# Altium project PROC114E3_SCH.PrjPcb (part 14 of 22)

## Sheet 28.SchDoc
size 513 x 386 mm
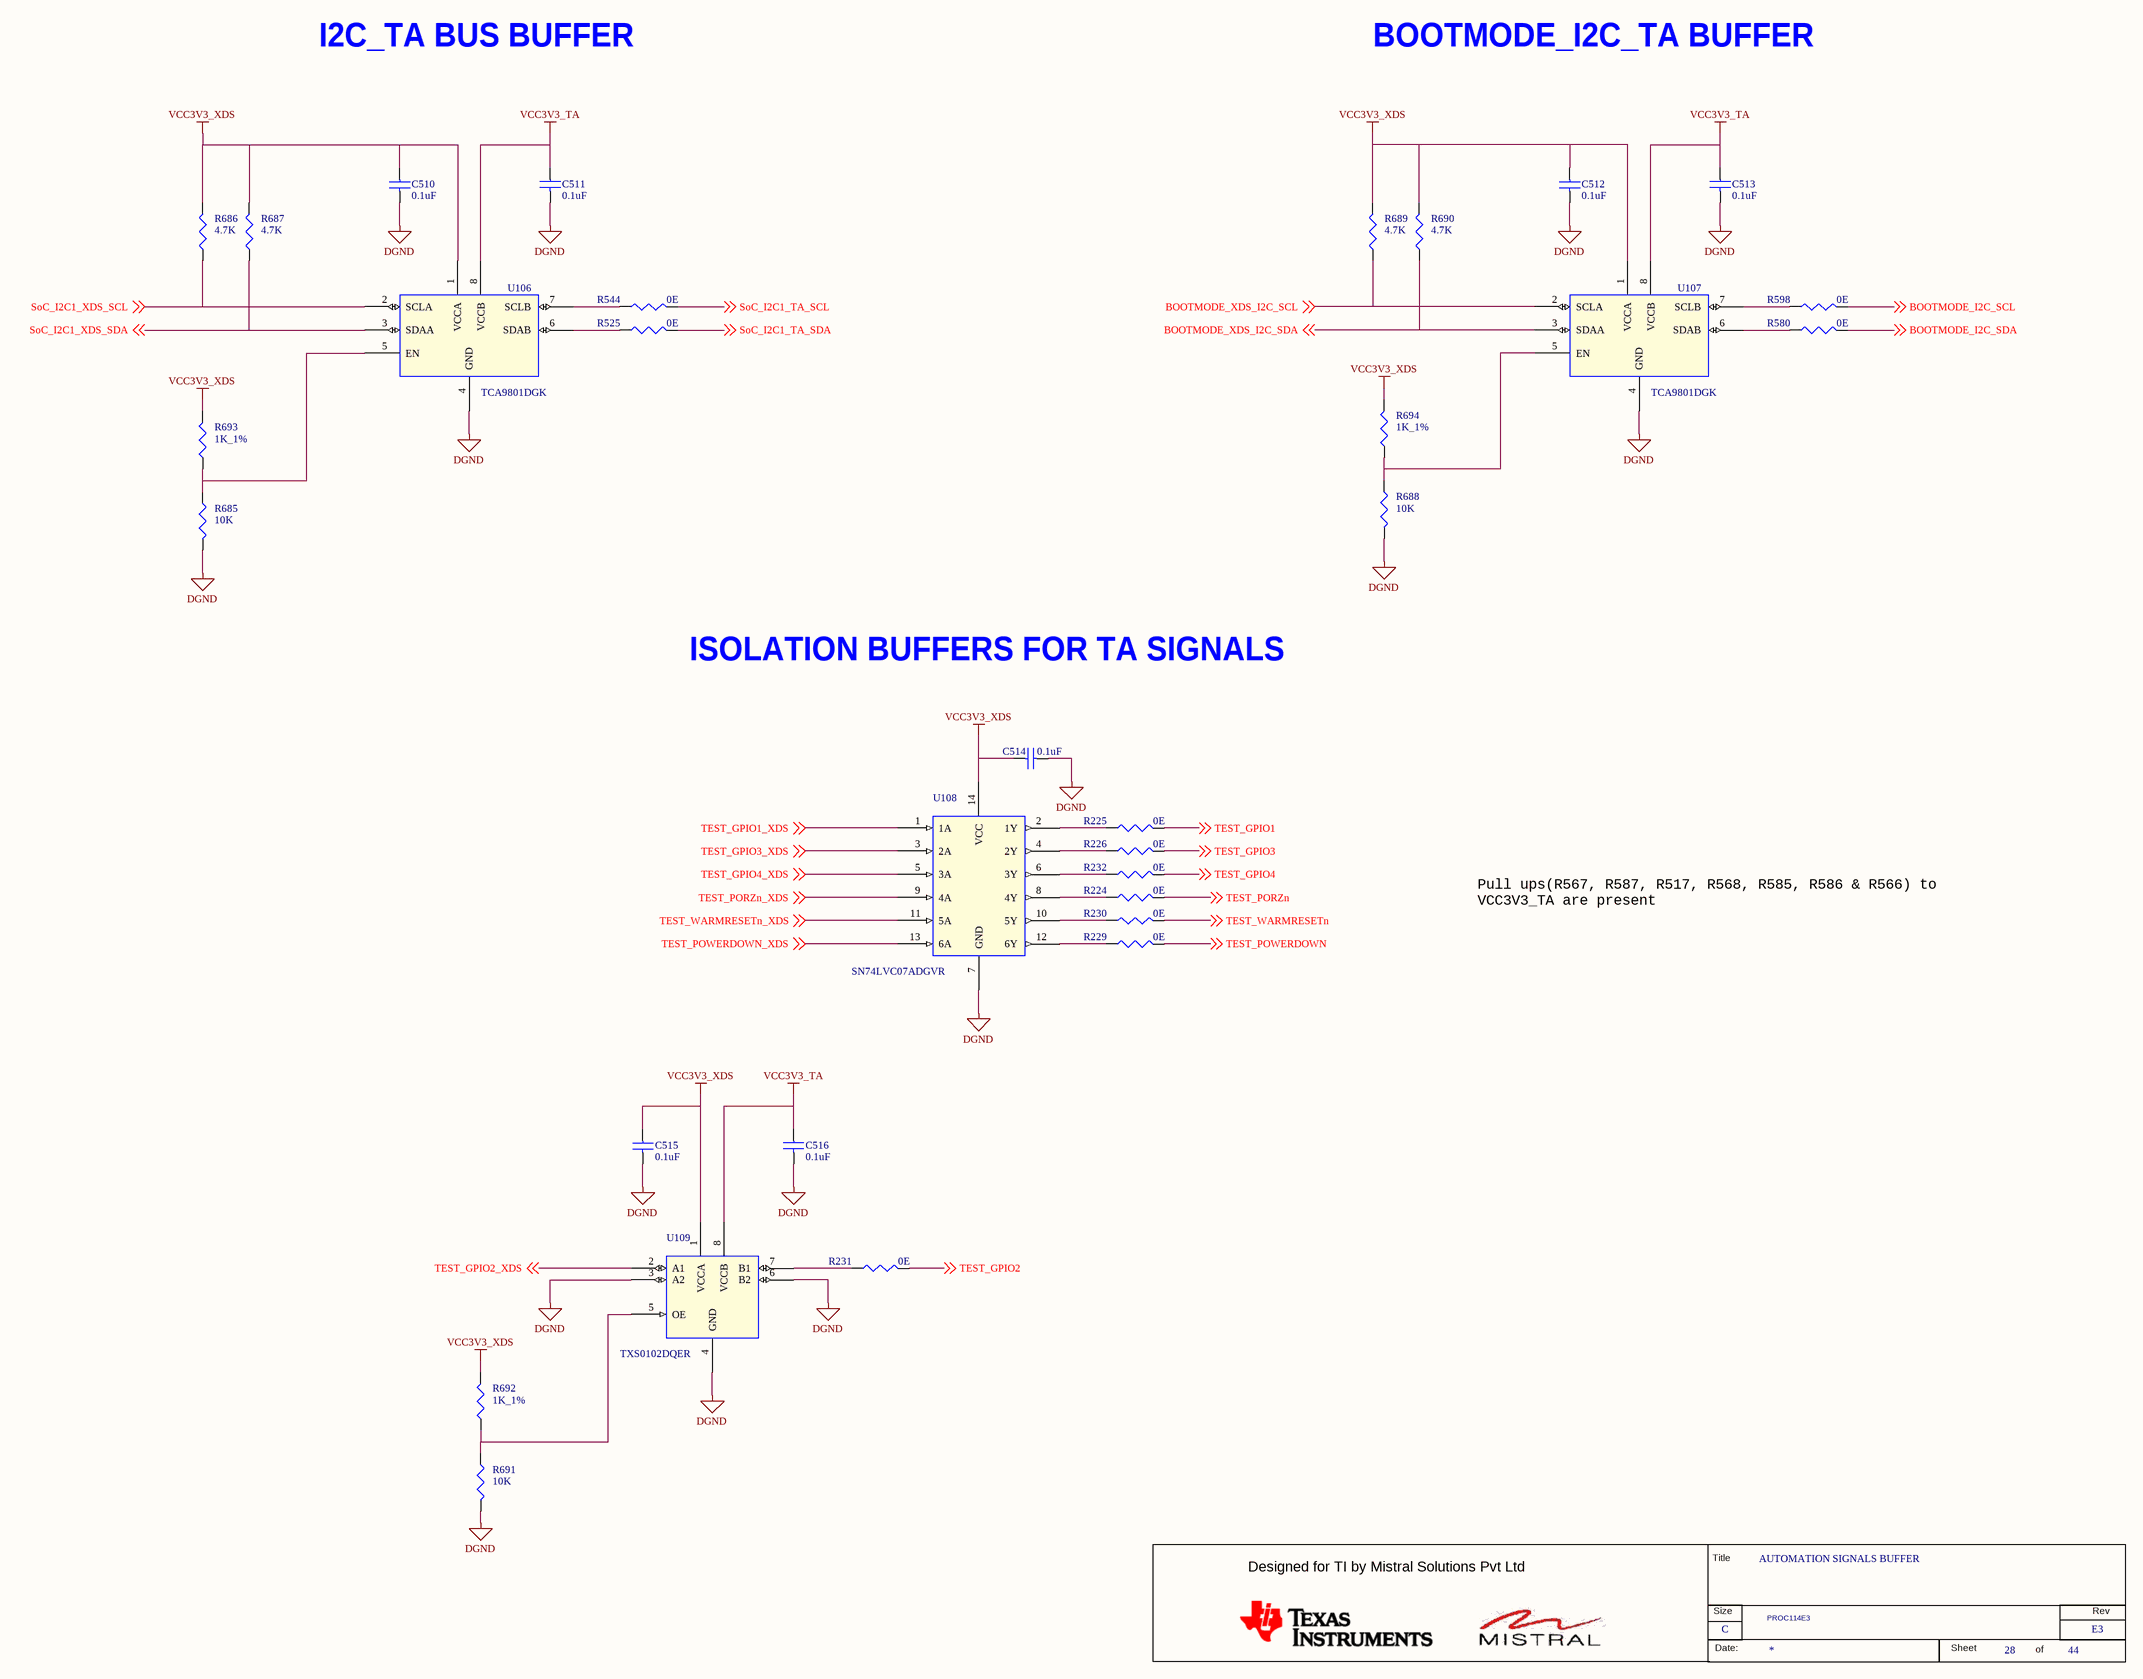
[diagram p45: 28.SchDoc]

### Parts
(Parts that share a designator on the sheet are numbered #1, #2 ... from top to bottom, then left to right.)
*#28  RevCode: E3  Title: AUTOMATION SIGNALS BUFFER  Page Size: C  Page Number: 28  Page Count: 44  Variant Name: PROC114E3  (hidden comment: MISTRAL_TITLEBLK_CSIZE)  (graphical)
C510  0.1uF  [CAP0201_0-5]
C511  0.1uF  [CAP0201_0-5]
C512  0.1uF  [CAP0201_0-5]
C513  0.1uF  [CAP0201_0-5]
C514  0.1uF  [CAP0201_0-5]
C515  0.1uF  [CAP0201_0-5]
C516  0.1uF  [CAP0201_0-5]
R224  0E  [RES0201_0-5]
R225  0E  [RES0201_0-5]
R226  0E  [RES0201_0-5]
R229  0E  [RES0201_0-5]
R230  0E  [RES0201_0-5]
R231  0E  [RES0201_0-5]
R232  0E  [RES0201_0-5]
R525  0E  [RES0201_0-5]
R544  0E  [RES0201_0-5]
R580  0E  [RES0201_0-5]
R598  0E  [RES0201_0-5]
R685  10K  [RES0201_0-5]
R686  4.7K  [RES0201_0-5]
R687  4.7K  [RES0201_0-5]
R688  10K  [RES0201_0-5]
R689  4.7K  [RES0201_0-5]
R690  4.7K  [RES0201_0-5]
R691  10K  [RES0201_0-5]
R692  1K_1%  [RES0402_0-5]
R693  1K_1%  [RES0402_0-5]
R694  1K_1%  [RES0402_0-5]
U106  TCA9801DGK  [VSSOP8_25-59_120X120_1-1]
U107  TCA9801DGK  [VSSOP8_25-59_120X120_1-1]
U108  SN74LVC07ADGVR  [TVSOP14_15-74_180X150_1-2]
U109  TXS0102DQER  [X2SON8_TXS0102_40X60_0-4]

### Nets
DGND: C510.2 C511.2 C512.2 C513.2 C514.2 C515.2 C516.2 R685.1 R688.1 R691.1 U106.4(GND) U107.4(GND) U108.7(GND) U109.3(A2) U109.4(GND) U109.6(B2)
VCC3V3_TA: C511.1 C513.1 C516.1 U106.8(VCCB) U107.8(VCCB) U109.8(VCCB)
VCC3V3_XDS: C510.1 C512.1 C514.1 C515.1 R686.1 R687.1 R689.1 R690.1 R692.2 R693.2 R694.2 U106.1(VCCA) U107.1(VCCA) U108.14(VCC) U109.1(VCCA)
BOOTMODE_I2C_SCL: R598.2 ; off-sheet BOOTMODE_I2C_SCL
BOOTMODE_I2C_SDA: R580.2 ; off-sheet BOOTMODE_I2C_SDA
BOOTMODE_XDS_I2C_SCL: R689.2 U107.2(SCLA) ; off-sheet BOOTMODE_XDS_I2C_SCL
BOOTMODE_XDS_I2C_SDA: R690.2 U107.3(SDAA) ; off-sheet BOOTMODE_XDS_I2C_SDA
SoC_I2C1_TA_SCL: R544.2 ; off-sheet SoC_I2C1_TA_SCL
SoC_I2C1_TA_SDA: R525.2 ; off-sheet SoC_I2C1_TA_SDA
SoC_I2C1_XDS_SCL: R686.2 U106.2(SCLA) ; off-sheet SoC_I2C1_XDS_SCL
SoC_I2C1_XDS_SDA: R687.2 U106.3(SDAA) ; off-sheet SoC_I2C1_XDS_SDA
TEST_GPIO1: R225.2 ; off-sheet TEST_GPIO1
TEST_GPIO1_XDS: U108.1(1A) ; off-sheet TEST_GPIO1_XDS
TEST_GPIO2: R231.2 ; off-sheet TEST_GPIO2
TEST_GPIO2_XDS: U109.2(A1) ; off-sheet TEST_GPIO2_XDS
TEST_GPIO3: R226.2 ; off-sheet TEST_GPIO3
TEST_GPIO3_XDS: U108.3(2A) ; off-sheet TEST_GPIO3_XDS
TEST_GPIO4: R232.2 ; off-sheet TEST_GPIO4
TEST_GPIO4_XDS: U108.5(3A) ; off-sheet TEST_GPIO4_XDS
TEST_PORZn: R224.2 ; off-sheet TEST_PORZn
TEST_PORZn_XDS: U108.9(4A) ; off-sheet TEST_PORZn_XDS
TEST_POWERDOWN: R229.2 ; off-sheet TEST_POWERDOWN
TEST_POWERDOWN_XDS: U108.13(6A) ; off-sheet TEST_POWERDOWN_XDS
TEST_WARMRESETn: R230.2 ; off-sheet TEST_WARMRESETn
TEST_WARMRESETn_XDS: U108.11(5A) ; off-sheet TEST_WARMRESETn_XDS
NetR224_1: R224.1 U108.8(4Y)
NetR225_1: R225.1 U108.2(1Y)
NetR226_1: R226.1 U108.4(2Y)
NetR229_1: R229.1 U108.12(6Y)
NetR230_1: R230.1 U108.10(5Y)
NetR231_1: R231.1 U109.7(B1)
NetR232_1: R232.1 U108.6(3Y)
NetR525_1: R525.1 U106.6(SDAB)
NetR544_1: R544.1 U106.7(SCLB)
NetR580_1: R580.1 U107.6(SDAB)
NetR598_1: R598.1 U107.7(SCLB)
NetR685_2: R685.2 R693.1 U106.5(EN)
NetR688_2: R688.2 R694.1 U107.5(EN)
NetR691_2: R691.2 R692.1 U109.5(OE)

### Notes on the sheet
- I2C_TA BUS BUFFER
- BOOTMODE_I2C_TA BUFFER
- ISOLATION BUFFERS FOR TA SIGNALS
- Pull ups(R567, R587, R517, R568, R585, R586 & R566) to
  VCC3V3_TA are present
- (in symbol MISTRAL_TITLEBLK_CSIZE) Title; Designed for TI by Mistral Solutions Pvt Ltd; Size; Rev; Date:; Sheet; of

### Library data of the parts
*#28 = MISTRAL_TITLEBLK_CSIZE: Issue: 1.0; Page Create Date: March  8, 1995; Page Modify Date: *
C510 C513 C516 = CAP_Dup2: as C325 on sheet 24; Tolerance: 10%; Voltage: 16V; Package: 0201; Distributor_name: DIGIKEY; Distributor_part_number: 490-14305-1-ND; Height: 0.33MM; Weight: 0.33mg; Temperature: -55°C+85°C; Datasheet: Y:\MIS_DATABASE\DATASHEETS\CAPACITORS\GRM033R61C104KE14.PDF; Crtd /date: MANIRAJA/230118; Chkd/date: MANIRAJA/230118; MECHANICAL 3D STEP FILE: CAP0201_0-5; Library Ref: CAP; Footprint Ref: CAP0201_0-5; Library Path: Y:\MIS_DATABASE\Library\ALTIUM_TOOL\SCHEMATICS_PARTS\MS_DISCRETE_Library.schlib; Footprint Path: Y:\MIS_DATABASE\Library\ALTIUM_TOOL\PCB_FOOTPRINTS\Altium_Footprint_Lib.PcbLib; PCB Footprint: CAP0201_0-5
C511 C512 C514 C515 = CAP_Dup2: as C474 on sheet 25; Footprint Path: Y:\MIS_DATABASE\Library\ALTIUM_TOOL\PCB_FOOTPRINTS\Altium_Footprint_Lib.PcbLib; Library Path: Y:\MIS_DATABASE\Library\ALTIUM_TOOL\SCHEMATICS_PARTS\MS_DISCRETE_Library.schlib; Footprint Ref: CAP0201_0-5; Library Ref: CAP; MECHANICAL 3D STEP FILE: CAP0201_0-5; Chkd/date: MANIRAJA/230118; Crtd /date: MANIRAJA/230118; Datasheet: Y:\MIS_DATABASE\DATASHEETS\CAPACITORS\GRM033R61C104KE14.PDF; Temperature: -55°C+85°C; Weight: 0.33mg; Height: 0.33MM; Distributor_part_number: 490-14305-1-ND; Distributor_name: DIGIKEY; Package: 0201; Voltage: 16V; Tolerance: 10%; PCB Footprint: CAP0201_0-5
R224 R226 R229 R231 R232 = RESISTOR_Dup6: RES 0E 1/20W 5% 0201; Part_type: RESISTORS\FIXED; Mfr_part_number: RC0201JR-070RL; Mfr_name: YAGEO AMERICA; Mistral Part No: 110010070067-R; Custom_Duty: 15%; Customs_HS_Code: 85332119; Voltage: NA; Project: PB_BUGBASE; Footprint Path: Y:\MIS_DATABASE\Library\ALTIUM_TOOL\PCB_FOOTPRINTS\Altium_Footprint_Lib.PcbLib; Library Path: Y:\MIS_DATABASE\Library\ALTIUM_TOOL\SCHEMATICS_PARTS\MS_DISCRETE_Library.schlib; MECHANICAL 3D STEP FILE: RES0201_0-5; Chkd/date: NAVEED/301214; Crtd /date: MUDDU/120710; Datasheet: Y:\MIS_DATABASE\DATASHEETS\RESISTORS\RCXXXXL-SER_MAR18.PDF; Temperature: -55°C+125°C; Weight: 0.17mg; Height: 0.26MM; Library Ref: RESISTOR; Distributor_part_number: 311-0.0NCT-ND; Distributor_name: DIGIKEY; Package: 0201; Wattage: 1/20W; Tolerance: 5%; Footprint Ref: RES0201_0-5; PCB Footprint: RES0201_0-5
R225 R230 R525 R544 R580 R598 = RESISTOR_Dup6: RES 0E 1/20W 5% 0201; Mistral Part No: 110010070067-R; Mfr_name: YAGEO AMERICA; Mfr_part_number: RC0201JR-070RL; Part_type: RESISTORS\FIXED; Project: PB_BUGBASE; Voltage: NA; Customs_HS_Code: 85332119; Custom_Duty: 15%; Footprint Ref: RES0201_0-5; Tolerance: 5%; Wattage: 1/20W; Package: 0201; Distributor_name: DIGIKEY; Distributor_part_number: 311-0.0NCT-ND; Library Ref: RESISTOR; Height: 0.26MM; Weight: 0.17mg; Temperature: -55°C+125°C; Datasheet: Y:\MIS_DATABASE\DATASHEETS\RESISTORS\RCXXXXL-SER_MAR18.PDF; Crtd /date: MUDDU/120710; Chkd/date: NAVEED/301214; MECHANICAL 3D STEP FILE: RES0201_0-5; Library Path: Y:\MIS_DATABASE\Library\ALTIUM_TOOL\SCHEMATICS_PARTS\MS_DISCRETE_Library.schlib; Footprint Path: Y:\MIS_DATABASE\Library\ALTIUM_TOOL\PCB_FOOTPRINTS\Altium_Footprint_Lib.PcbLib; PCB Footprint: RES0201_0-5
R685 R688 R691 = RESISTOR_Dup6: as R162 on sheet 24; PCB Footprint: RES0201_0-5; Footprint Path: Y:\MIS_DATABASE\Library\ALTIUM_TOOL\PCB_FOOTPRINTS\Altium_Footprint_Lib.PcbLib; Library Path: Y:\MIS_DATABASE\Library\ALTIUM_TOOL\SCHEMATICS_PARTS\MS_DISCRETE_Library.schlib; Footprint Ref: RES0201_0-5; Library Ref: RESISTOR; Tolerance: 5%; Wattage: 1/20W; Package: 0201; Distributor_name: DIGIKEY; Distributor_part_number: 311-10KNCT-ND; Height: 0.26MM; Weight: 0.17mg; Temperature: -55°C+125°C; Datasheet: Y:\MIS_DATABASE\DATASHEETS\RESISTORS\RCXXXXL-SER_MAR18.PDF; Crtd /date: MANIRAJA/050517; Chkd/date: MANIRAJA/050517; MECHANICAL 3D STEP FILE: RES0201_0-5
R686 R687 = RESISTOR_Dup6: as R498 on sheet 25; Footprint Path: Y:\MIS_DATABASE\Library\ALTIUM_TOOL\PCB_FOOTPRINTS\Altium_Footprint_Lib.PcbLib; Library Path: Y:\MIS_DATABASE\Library\ALTIUM_TOOL\SCHEMATICS_PARTS\MS_DISCRETE_Library.schlib; MECHANICAL 3D STEP FILE: RES0201_0-5; Chkd/date: MANIRAJA/200921; Crtd /date: ALVY/200921; Datasheet: Y:\MIS_DATABASE\DATASHEETS\RESISTORS\RCXXXXL-SER_MAR18.PDF; Temperature: -55°C+125°C; Weight: 0.17mg; Height: 0.26MM; Library Ref: RESISTOR; Distributor_part_number: 311-4.7KNCT-ND; Distributor_name: DIGIKEY; Package: 0201; Wattage: 1/20W; Tolerance: 5%; Footprint Ref: RES0201_0-5; PCB Footprint: RES0201_0-5
R689 R690 = RESISTOR_Dup6: as R600 on sheet 25; Footprint Ref: RES0201_0-5; Tolerance: 5%; Wattage: 1/20W; Package: 0201; Distributor_name: DIGIKEY; Distributor_part_number: 311-4.7KNCT-ND; Library Ref: RESISTOR; Height: 0.26MM; Weight: 0.17mg; Temperature: -55°C+125°C; Datasheet: Y:\MIS_DATABASE\DATASHEETS\RESISTORS\RCXXXXL-SER_MAR18.PDF; Crtd /date: ALVY/200921; Chkd/date: MANIRAJA/200921; MECHANICAL 3D STEP FILE: RES0201_0-5; Library Path: Y:\MIS_DATABASE\Library\ALTIUM_TOOL\SCHEMATICS_PARTS\MS_DISCRETE_Library.schlib; Footprint Path: Y:\MIS_DATABASE\Library\ALTIUM_TOOL\PCB_FOOTPRINTS\Altium_Footprint_Lib.PcbLib; PCB Footprint: RES0201_0-5
R692 R694 = RESISTOR_Dup4: as R527 on sheet 26; PCB Footprint: RES0402_0-5; Chkd/date: VASANTHA/281216; Crtd /date: MAZHAR/150506; Datasheet: Y:\MIS_DATABASE\DATASHEETS\RESISTORS\PAN-ERJSER_NOV17.PDF; Temperature: -55°C+155°C; Weight: 0.8mg; Height: 0.40MM; Distributor_part_number: P1.00KLCT-ND; Distributor_name: DIGIKEY; Package: 0402; Wattage: 1/10W; Tolerance: 1%; Library Ref: RESISTOR; Footprint Ref: RES0402_0-5; MECHANICAL 3D STEP FILE: RES0402_0-5; Library Path: Y:\MIS_DATABASE\Library\ALTIUM_TOOL\SCHEMATICS_PARTS\MS_DISCRETE_Library.schlib; Footprint Path: Y:\MIS_DATABASE\Library\ALTIUM_TOOL\PCB_FOOTPRINTS\Altium_Footprint_Lib.PcbLib
R693 = RESISTOR_Dup4: as R255 on sheet 27; PCB Footprint: RES0402_0-5; Footprint Path: Y:\MIS_DATABASE\Library\ALTIUM_TOOL\PCB_FOOTPRINTS\Altium_Footprint_Lib.PcbLib; Library Path: Y:\MIS_DATABASE\Library\ALTIUM_TOOL\SCHEMATICS_PARTS\MS_DISCRETE_Library.schlib; MECHANICAL 3D STEP FILE: RES0402_0-5; Footprint Ref: RES0402_0-5; Library Ref: RESISTOR; Tolerance: 1%; Wattage: 1/10W; Package: 0402; Distributor_name: DIGIKEY; Distributor_part_number: P1.00KLCT-ND; Height: 0.40MM; Weight: 0.8mg; Temperature: -55°C+155°C; Datasheet: Y:\MIS_DATABASE\DATASHEETS\RESISTORS\PAN-ERJSER_NOV17.PDF; Crtd /date: MAZHAR/150506; Chkd/date: VASANTHA/281216
U106 U107 = TCA9801DGK_VSSOP8: IC LEVEL TRANSLATING I2C BUS BUFFER/REPEATER VSSOP8; Part_type: ICS\INTERFACE\LEVEL TRANSLATOR; Mfr_part_number: TCA9801DGKT; Mfr_name: TEXAS INSTRUMENTS; Mistral Part No: 141018070002-R; Custom_Duty: 15%; Customs_HS_Code: 85423100; Wattage: NA; Project: DARE_RFAM_RF; PCB Footprint: VSSOP8_25-59_120X120_1-1; Footprint Path: Y:\MIS_DATABASE\Library\ALTIUM_TOOL\PCB_FOOTPRINTS\Altium_Footprint_Lib.PcbLib; Library Path: Y:\MIS_DATABASE\Library\ALTIUM_TOOL\SCHEMATICS_PARTS\MS_MISCINTERFACE_Library.schlib; MECHANICAL 3D STEP FILE: VSSOP8_25-59_120X120_1-1; Chkd/date: MANIRAJA/020718; Crtd /date: MANIRAJA/020718; Datasheet: Y:\MIS_DATABASE\DATASHEETS\ICS\INTERFACE\TCA9801DGK.PDF; Temperature: -40°C+85°C; Weight: 20mg; Height: 1.10MM; Library Ref: TCA9801DGK_VSSOP8; Distributor_part_number: 296-46571-1-ND; Distributor_name: DIGIKEY; Package: VSSOP8; Voltage: NA; Tolerance: NA; Footprint Ref: VSSOP8_25-59_120X120_1-1
U108 = 74HC7014X_SOIC14: IC HEX BUFFER AND DRIVER WITH OPEN DRAIN OUTPUT TVSOP14; Part_type: ICS\DIGITAL\COMBINATIONAL; Mfr_name: TEXAS INSTRUMENTS; Mistral Part No: 141022040005-R; Custom_Duty: 15%; Customs_HS_Code: 85423100; Wattage: NA; Project: TI_AM62x_SKEVM_BRD; Footprint Path: Y:\MIS_DATABASE\Library\ALTIUM_TOOL\PCB_FOOTPRINTS\Altium_Footprint_Lib.PcbLib; Library Path: Y:\MIS_DATABASE\Library\ALTIUM_TOOL\SCHEMATICS_PARTS\MS_COMBINATIONAL_Library.schlib; MECHANICAL 3D STEP FILE: TVSOP14_15-74_180X150_1-2; Chkd/date: ALVY/070422; Crtd /date: TAMILARASU/070422; Datasheet: Y:\MIS_DATABASE\DATASHEETS\ICS\DIGITAL\COMBINATIONAL\SN74LVC07A.PDF; Temperature: -40°C+125°C; Weight: 41.8mg; Height: 1.20MM; Library Ref: 74HC7014X_SOIC14; Distributor_part_number: 296-8440-1-ND; Distributor_name: DIGIKEY; Package: TVSOP14; Voltage: NA; Tolerance: NA; Mfr_part_number: SN74LVC07ADGVR; Footprint Ref: TVSOP14_15-74_180X150_1-2; PCB Footprint: TVSOP14_15-74_180X150_1-2
U109 = TXS0102DQX_SON8: IC 2-BIT BI-DIR VOLTAGE-LEVEL TRANSLATOR FOR OPEN-DRAIN AND PUSH-PULL X2SON8; Part_type: ICS\INTERFACE\LEVEL TRANSLATOR; Mfr_name: TEXAS INSTRUMENTS; Mistral Part No: 141012050010-R; Custom_Duty: 15%; Customs_HS_Code: 85423100; Wattage: NA; Project: GEN_3-8_DB; PCB Footprint: X2SON8_TXS0102_40X60_0-4; Footprint Path: Y:\MIS_DATABASE\Library\ALTIUM_TOOL\PCB_FOOTPRINTS\Altium_Footprint_Lib.PcbLib; Library Path: Y:\MIS_DATABASE\Library\ALTIUM_TOOL\SCHEMATICS_PARTS\MS_MISCINTERFACE_Library.schlib; MECHANICAL 3D STEP FILE: X2SON8_TXS0102_40X60_0-4; Chkd/date: MANIRAJA/010719; Crtd /date: CHAITHANYA230512; Datasheet: Y:\MIS_DATABASE\DATASHEETS\ICS\INTERFACE\TXS0102-SER.PDF; Temperature: -40°C+85°C; Weight: 1.2mg; Height: 0.40MM; Library Ref: TXS0102DQX_SON8; Distributor_part_number: 296-28368-1-ND; Distributor_name: DIGIKEY; Package: X2SON8; Voltage: NA; Tolerance: NA; Mfr_part_number: TXS0102DQER; Footprint Ref: X2SON8_TXS0102_40X60_0-4

## Sheet 29.SchDoc
size 513 x 386 mm
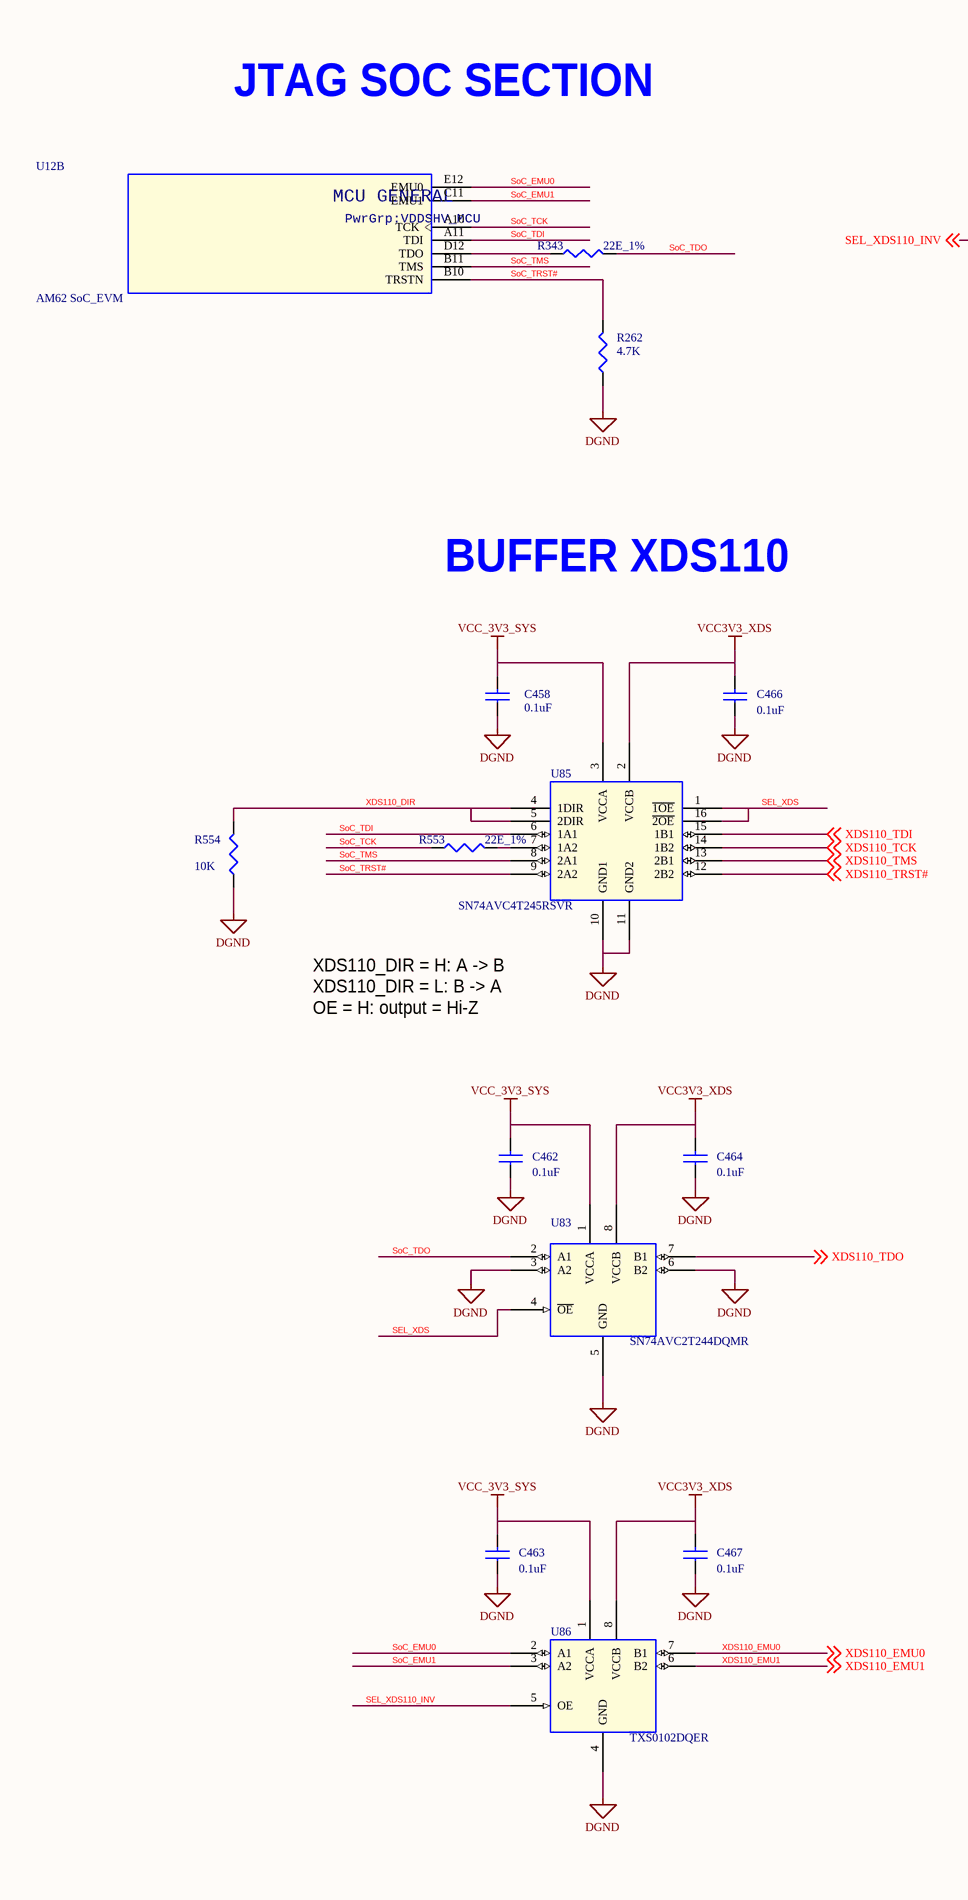
[diagram p46: 29.SchDoc, left]
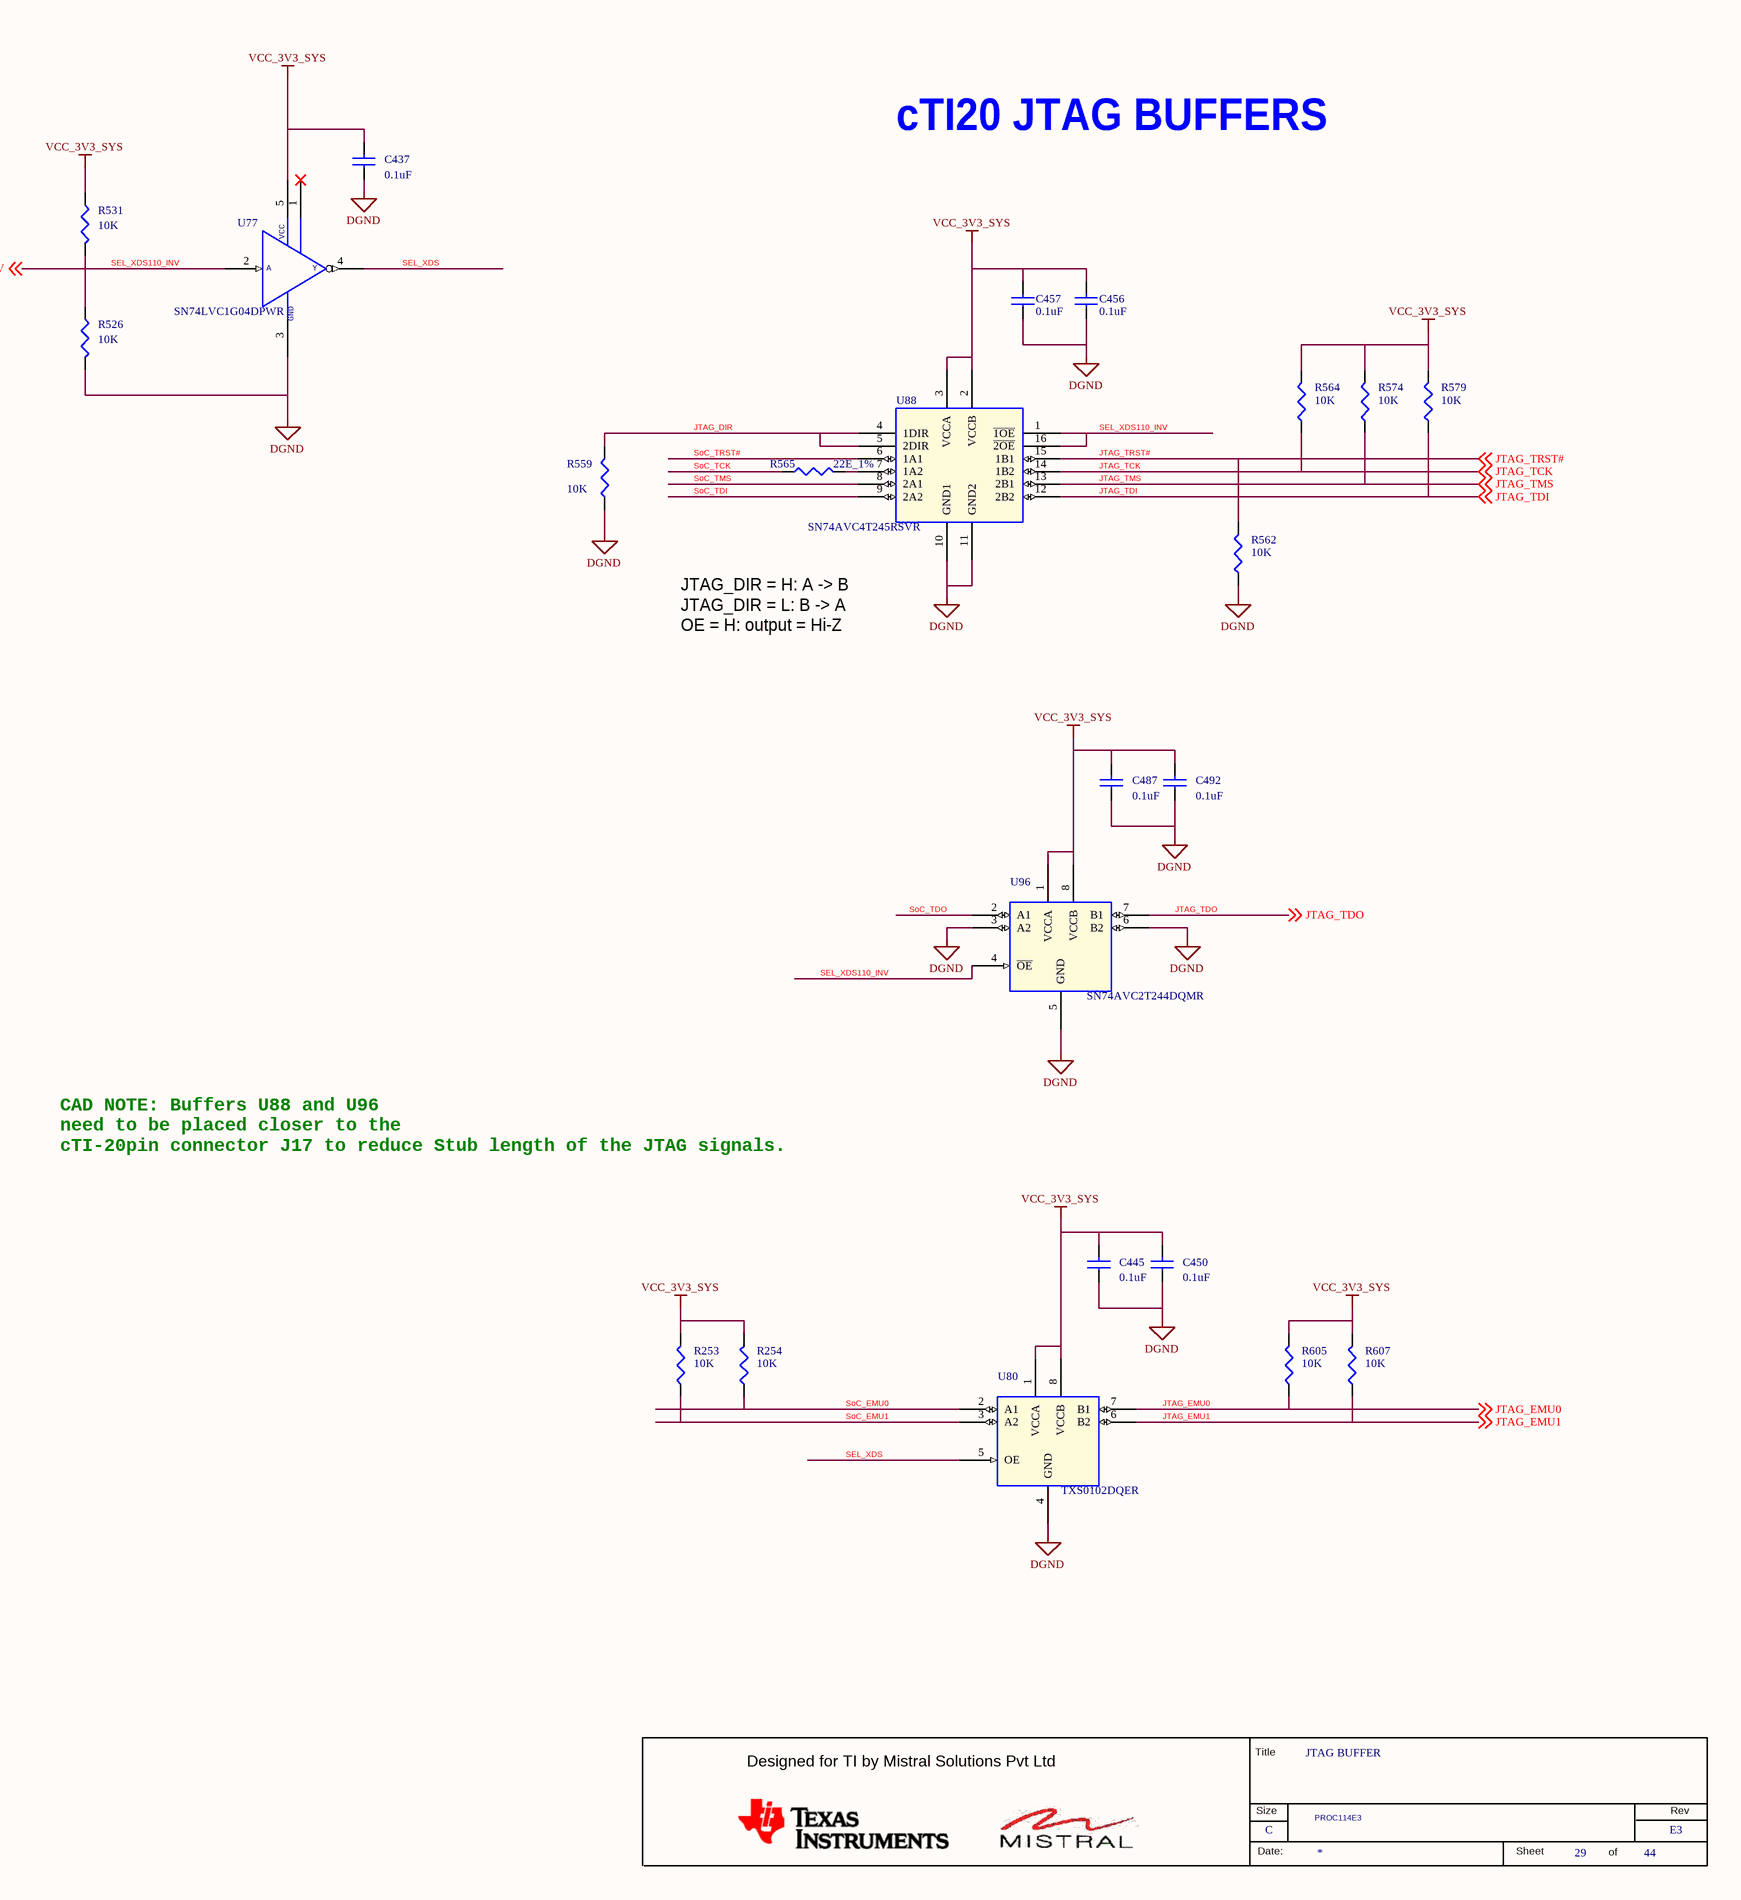
[diagram p47: 29.SchDoc, right]

### Parts
(Parts that share a designator on the sheet are numbered #1, #2 ... from top to bottom, then left to right.)
*#29  RevCode: E3  Title: JTAG BUFFER  Page Size: C  Page Number: 29  Page Count: 44  Variant Name: PROC114E3  (hidden comment: MISTRAL_TITLEBLK_CSIZE)  (graphical)
C437  0.1uF  [CAP0201_0-5]
C445  0.1uF  [CAP0201_0-5]
C450  0.1uF  [CAP0201_0-5]
C456  0.1uF  [CAP0201_0-5]
C457  0.1uF  [CAP0201_0-5]
C458  0.1uF  [CAP0201_0-5]
C462  0.1uF  [CAP0201_0-5]
C463  0.1uF  [CAP0201_0-5]
C464  0.1uF  [CAP0201_0-5]
C466  0.1uF  [CAP0201_0-5]
C467  0.1uF  [CAP0201_0-5]
C487  0.1uF  [CAP0201_0-5]
C492  0.1uF  [CAP0201_0-5]
R253  10K  [RES0201_0-5]
R254  10K  [RES0201_0-5]
R262  4.7K  [RES0201_0-5]
R343  22E_1%  [RES0201_0-5]
R526  10K  [RES0201_0-5]
R531  10K  [RES0201_0-5]
R553  22E_1%  [RES0201_0-5]
R554  10K  [RES0201_0-5]
R559  10K  [RES0201_0-5]
R562  10K  [RES0201_0-5]
R564  10K  [RES0201_0-5]
R565  22E_1%  [RES0201_0-5]
R574  10K  [RES0201_0-5]
R579  10K  [RES0201_0-5]
R605  10K  [RES0201_0-5]
R607  10K  [RES0201_0-5]
U12#2  AM62 SoC_EVM  [BGA425_19-68_510X510_0-7]  (part B of 18)
U77  SN74LVC1G04DPWR  [X2SON5_TLV7021_30X30_0-4]
U80  TXS0102DQER  [X2SON8_TXS0102_40X60_0-4]
U83  SN74AVC2T244DQMR  [X2SON8_15-74_70X50]
U85  SN74AVC4T245RSVR  [UQFN16_TMUX1574_70X100_0-6]
U86  TXS0102DQER  [X2SON8_TXS0102_40X60_0-4]
U88  SN74AVC4T245RSVR  [UQFN16_TMUX1574_70X100_0-6]
U96  SN74AVC2T244DQMR  [X2SON8_15-74_70X50]

### Nets
DGND: C437.1 C445.1 C450.1 C456.1 C457.1 C458.1 C462.1 C463.1 C464.1 C466.1 C467.1 C487.1 C492.1 R262.2 R526.1 R554.1 R559.1 R562.1 U77.3(GND) U80.4(GND) U83.3(A2) U83.5(GND) U83.6(B2) U85.10(GND1) U85.11(GND2) U86.4(GND) U88.10(GND1) U88.11(GND2) U96.3(A2) U96.5(GND) U96.6(B2)
VCC3V3_XDS: C464.2 C466.2 C467.2 U83.8(VCCB) U85.2(VCCB) U86.8(VCCB)
VCC_3V3_SYS: C437.2 C445.2 C450.2 C456.2 C457.2 C458.2 C462.2 C463.2 C487.2 C492.2 R253.1 R254.1 R531.2 R564.2 R574.2 R579.2 R605.1 R607.1 U77.5(VCC) U80.1(VCCA) U80.8(VCCB) U83.1(VCCA) U85.3(VCCA) U86.1(VCCA) U88.2(VCCB) U88.3(VCCA) U96.1(VCCA) U96.8(VCCB)
JTAG_DIR: R559.2 U88.4(1DIR) U88.5(2DIR)
JTAG_EMU0: R605.2 U80.7(B1) ; off-sheet JTAG_EMU0
JTAG_EMU1: R607.2 U80.6(B2) ; off-sheet JTAG_EMU1
JTAG_TCK: R564.1 U88.14(1B2) ; off-sheet JTAG_TCK
JTAG_TDI: R579.1 U88.12(2B2) ; off-sheet JTAG_TDI
JTAG_TDO: U96.7(B1) ; off-sheet JTAG_TDO
JTAG_TMS: R574.1 U88.13(2B1) ; off-sheet JTAG_TMS
JTAG_TRST#: R562.2 U88.15(1B1) ; off-sheet JTAG_TRST#
SEL_XDS: U77.4(Y) U80.5(OE) U83.4(~{OE}) U85.1(~{1OE}) U85.16(~{2OE})
SEL_XDS110_INV: R526.2 R531.1 U77.2(A) U86.5(OE) U88.1(~{1OE}) U88.16(~{2OE}) U96.4(~{OE}) ; off-sheet SEL_XDS110_INV
SoC_EMU0: R254.2 U12#2.E12(EMU0) U80.2(A1) U86.2(A1)
SoC_EMU1: R253.2 U12#2.C11(EMU1) U80.3(A2) U86.3(A2)
SoC_TCK: R553.1 R565.1 U12#2.A10(TCK)
SoC_TDI: U12#2.A11(TDI) U85.6(1A1) U88.9(2A2)
SoC_TDO: R343.1 U83.2(A1) U96.2(A1)
SoC_TMS: U12#2.B11(TMS) U85.8(2A1) U88.8(2A1)
SoC_TRST#: R262.1 U12#2.B10(TRSTN) U85.9(2A2) U88.6(1A1)
XDS110_DIR: R554.2 U85.4(1DIR) U85.5(2DIR)
XDS110_EMU0: U86.7(B1) ; off-sheet XDS110_EMU0
XDS110_EMU1: U86.6(B2) ; off-sheet XDS110_EMU1
XDS110_TCK: U85.14(1B2) ; off-sheet XDS110_TCK
XDS110_TDI: U85.15(1B1) ; off-sheet XDS110_TDI
XDS110_TDO: U83.7(B1) ; off-sheet XDS110_TDO
XDS110_TMS: U85.13(2B1) ; off-sheet XDS110_TMS
XDS110_TRST#: U85.12(2B2) ; off-sheet XDS110_TRST#
NetR343_2: R343.2 U12#2.D12(TDO)
NetR553_2: R553.2 U85.7(1A2)
NetR565_2: R565.2 U88.7(1A2)

Not connected (* = marked no-connect by the designer): U77 1(NC)*

### Notes on the sheet
- JTAG SOC SECTION
- cTI20 JTAG BUFFERS
- JTAG_DIR = H: A -> B
  JTAG_DIR = L: B -> A
  OE = H: output = Hi-Z
- BUFFER XDS110
- XDS110_DIR = H: A -> B
  XDS110_DIR = L: B -> A
  OE = H: output = Hi-Z
- CAD NOTE: Buffers U88 and U96
  need to be placed closer to the
  cTI-20pin connector J17 to reduce Stub length of the JTAG signals.
- (in symbol AM62-EVM_BGA425, part B) MCU GENERAL; PwrGrp:VDDSHV_MCU
- (in symbol MISTRAL_TITLEBLK_CSIZE) Title; Designed for TI by Mistral Solutions Pvt Ltd; Size; Rev; Date:; Sheet; of

### Library data of the parts
*#29 = MISTRAL_TITLEBLK_CSIZE: Issue: 1.0; Page Create Date: March  8, 1995; Page Modify Date: *; Schematic Page Count: 44; Schematic Page Number: 29
C437 C445 C466 C467 C492 = CAP_Dup2: as C474 on sheet 25; PCB Footprint: CAP0201_0-5; Footprint Path: Y:\MIS_DATABASE\Library\ALTIUM_TOOL\PCB_FOOTPRINTS\Altium_Footprint_Lib.PcbLib; Library Path: Y:\MIS_DATABASE\Library\ALTIUM_TOOL\SCHEMATICS_PARTS\MS_DISCRETE_Library.schlib; Footprint Ref: CAP0201_0-5; Library Ref: CAP; MECHANICAL 3D STEP FILE: CAP0201_0-5; Chkd/date: MANIRAJA/230118; Crtd /date: MANIRAJA/230118; Datasheet: Y:\MIS_DATABASE\DATASHEETS\CAPACITORS\GRM033R61C104KE14.PDF; Temperature: -55°C+85°C; Weight: 0.33mg; Height: 0.33MM; Distributor_part_number: 490-14305-1-ND; Distributor_name: DIGIKEY; Package: 0201; Voltage: 16V; Tolerance: 10%
C450 C456-C458 C462-C464 C487 = CAP_Dup2: as C325 on sheet 24; PCB Footprint: CAP0201_0-5; Tolerance: 10%; Voltage: 16V; Package: 0201; Distributor_name: DIGIKEY; Distributor_part_number: 490-14305-1-ND; Height: 0.33MM; Weight: 0.33mg; Temperature: -55°C+85°C; Datasheet: Y:\MIS_DATABASE\DATASHEETS\CAPACITORS\GRM033R61C104KE14.PDF; Crtd /date: MANIRAJA/230118; Chkd/date: MANIRAJA/230118; MECHANICAL 3D STEP FILE: CAP0201_0-5; Library Ref: CAP; Footprint Ref: CAP0201_0-5; Library Path: Y:\MIS_DATABASE\Library\ALTIUM_TOOL\SCHEMATICS_PARTS\MS_DISCRETE_Library.schlib; Footprint Path: Y:\MIS_DATABASE\Library\ALTIUM_TOOL\PCB_FOOTPRINTS\Altium_Footprint_Lib.PcbLib
R253 R531 R554 R562 R605 = RESISTOR_Dup6: as R160 on sheet 24; Footprint Path: Y:\MIS_DATABASE\Library\ALTIUM_TOOL\PCB_FOOTPRINTS\Altium_Footprint_Lib.PcbLib; Library Path: Y:\MIS_DATABASE\Library\ALTIUM_TOOL\SCHEMATICS_PARTS\MS_DISCRETE_Library.schlib; MECHANICAL 3D STEP FILE: RES0201_0-5; Chkd/date: MANIRAJA/050517; Crtd /date: MANIRAJA/050517; Datasheet: Y:\MIS_DATABASE\DATASHEETS\RESISTORS\RCXXXXL-SER_MAR18.PDF; Temperature: -55°C+125°C; Weight: 0.17mg; Height: 0.26MM; Library Ref: RESISTOR; Distributor_part_number: 311-10KNCT-ND; Distributor_name: DIGIKEY; Package: 0201; Wattage: 1/20W; Tolerance: 5%; Footprint Ref: RES0201_0-5; PCB Footprint: RES0201_0-5
R254 R526 R559 R564 R574 R579 R607 = RESISTOR_Dup6: as R162 on sheet 24; Footprint Ref: RES0201_0-5; Tolerance: 5%; Wattage: 1/20W; Package: 0201; Distributor_name: DIGIKEY; Distributor_part_number: 311-10KNCT-ND; Library Ref: RESISTOR; Height: 0.26MM; Weight: 0.17mg; Temperature: -55°C+125°C; Datasheet: Y:\MIS_DATABASE\DATASHEETS\RESISTORS\RCXXXXL-SER_MAR18.PDF; Crtd /date: MANIRAJA/050517; Chkd/date: MANIRAJA/050517; MECHANICAL 3D STEP FILE: RES0201_0-5; Library Path: Y:\MIS_DATABASE\Library\ALTIUM_TOOL\SCHEMATICS_PARTS\MS_DISCRETE_Library.schlib; Footprint Path: Y:\MIS_DATABASE\Library\ALTIUM_TOOL\PCB_FOOTPRINTS\Altium_Footprint_Lib.PcbLib; PCB Footprint: RES0201_0-5
R262 = RESISTOR_Dup6: as R498 on sheet 25; PCB Footprint: RES0201_0-5; Footprint Path: Y:\MIS_DATABASE\Library\ALTIUM_TOOL\PCB_FOOTPRINTS\Altium_Footprint_Lib.PcbLib; Library Path: Y:\MIS_DATABASE\Library\ALTIUM_TOOL\SCHEMATICS_PARTS\MS_DISCRETE_Library.schlib; MECHANICAL 3D STEP FILE: RES0201_0-5; Chkd/date: MANIRAJA/200921; Crtd /date: ALVY/200921; Datasheet: Y:\MIS_DATABASE\DATASHEETS\RESISTORS\RCXXXXL-SER_MAR18.PDF; Temperature: -55°C+125°C; Weight: 0.17mg; Height: 0.26MM; Library Ref: RESISTOR; Distributor_part_number: 311-4.7KNCT-ND; Distributor_name: DIGIKEY; Package: 0201; Wattage: 1/20W; Tolerance: 5%; Footprint Ref: RES0201_0-5
R343 R553 R565 = RESISTOR_Dup6: RES 22E 1/20W 1% 0201; Mistral Part No: 110009030522-R; Mfr_name: YAGEO AMERICA; Mfr_part_number: RC0201FR-0722RL; Part_type: RESISTORS\FIXED; Project: AM654x_SOM; Voltage: NA; Customs_HS_Code: 85332119; Custom_Duty: 15%; PCB Footprint: RES0201_0-5; Footprint Ref: RES0201_0-5; Tolerance: 1%; Wattage: 1/20W; Package: 0201; Distributor_name: DIGIKEY; Distributor_part_number: YAG2518CT-ND; Library Ref: RESISTOR; Height: 0.26MM; Weight: 0.17mg; Temperature: -55°C+125°C; Datasheet: Y:\MIS_DATABASE\DATASHEETS\RESISTORS\RCXXXXL-SER_MAR18.PDF; Crtd /date: ALVY/080319; Chkd/date: MANIRAJA/080319; MECHANICAL 3D STEP FILE: RES0201_0-5; Library Path: Y:\MIS_DATABASE\Library\ALTIUM_TOOL\SCHEMATICS_PARTS\MS_DISCRETE_Library.schlib; Footprint Path: Y:\MIS_DATABASE\Library\ALTIUM_TOOL\PCB_FOOTPRINTS\Altium_Footprint_Lib.PcbLib
U12#2 = AM62-EVM_BGA425: IC AM62 SoC MICROPROCESSOR BGA425; Mistral Part No: 141221060001; Mfr_name: TEXAS INSTRUMENTS; Part_type: ICS\DIGITAL\MICROPROCESSOR; Project: AM62_EVM_BRD; Tolerance: NA; Customs_HS_Code: 85423100; Custom_Duty: 15%; PCB Footprint: BGA425_19-68_510X510_0-7; Mfr_part_number: AM62 SoC_EVM; Voltage: NA; Wattage: NA; Package: BGA425; Distributor_name: NA; Distributor_part_number: NA; Library Ref: AM62-EVM_BGA425; Footprint Ref: BGA425_19-68_510X510_0-7; Height: 0.65MM; Weight: NA; Temperature: NA; Datasheet: Y:\MIS_DATABASE\DATASHEETS\ICS\DIGITAL\MICROCONTROLLER\AM62-SoC_SVB.PDF; Crtd /date: MANIRAJA/110621; Chkd/date: ALVY/110621; RoHS: NA; MECHANICAL 3D STEP FILE: BGA425_19-68_510X510_0-7; Library Path: Y:\MIS_DATABASE\Library\ALTIUM_TOOL\SCHEMATICS_PARTS\MS_MICROPROCESSOR_Library.schlib; Footprint Path: Y:\MIS_DATABASE\Library\ALTIUM_TOOL\PCB_FOOTPRINTS\Altium_Footprint_Lib.PcbLib
U77 = SN74LVC1G04DCKR_SC70-5: IC SINGLE INVERTER GATE X2SON5; Part_type: ICS\DIGITAL\GATES; Mfr_name: TEXAS INSTRUMENTS; Mistral Part No: 141020100010-R; Custom_Duty: 15%; Customs_HS_Code: 85423100; Wattage: NA; Project: AM64X_SKEVM; PCB Footprint: X2SON5_TLV7021_30X30_0-4; Footprint Path: Y:\MIS_DATABASE\Library\ALTIUM_TOOL\PCB_FOOTPRINTS\Altium_Footprint_Lib.PcbLib; Library Path: Y:\MIS_DATABASE\Library\ALTIUM_TOOL\SCHEMATICS_PARTS\MS_GATE_Library.schlib; MECHANICAL 3D STEP FILE: X2SON5_TLV7021_30X30_0-4; Chkd/date: MANIRAJA/141020; Crtd /date: ALVY/131020; Datasheet: Y:\MIS_DATABASE\DATASHEETS\ICS\DIGITAL\GATES\SN74LVC1G04XX.PDF; Temperature: -40°C+125°C; Weight: 0.6mg; Height: 0.40MM; Library Ref: SN74LVC1G04DCKR_SC70-5; Distributor_part_number: 296-37758-1-ND; Distributor_name: DIGIKEY; Package: X2SON5; Voltage: NA; Tolerance: NA; Mfr_part_number: SN74LVC1G04DPWR; Footprint Ref: X2SON5_TLV7021_30X30_0-4
U80 = TXS0102DQX_SON8: as U109 on sheet 28; PCB Footprint: X2SON8_TXS0102_40X60_0-4; Footprint Path: Y:\MIS_DATABASE\Library\ALTIUM_TOOL\PCB_FOOTPRINTS\Altium_Footprint_Lib.PcbLib; Library Path: Y:\MIS_DATABASE\Library\ALTIUM_TOOL\SCHEMATICS_PARTS\MS_MISCINTERFACE_Library.schlib; MECHANICAL 3D STEP FILE: X2SON8_TXS0102_40X60_0-4; Chkd/date: MANIRAJA/010719; Crtd /date: CHAITHANYA230512; Datasheet: Y:\MIS_DATABASE\DATASHEETS\ICS\INTERFACE\TXS0102-SER.PDF; Temperature: -40°C+85°C; Weight: 1.2mg; Height: 0.40MM; Library Ref: TXS0102DQX_SON8; Distributor_part_number: 296-28368-1-ND; Distributor_name: DIGIKEY; Package: X2SON8; Voltage: NA; Tolerance: NA; Mfr_part_number: TXS0102DQER; Footprint Ref: X2SON8_TXS0102_40X60_0-4
U83 = SN74AVC2T244DQMR_X2SON8: IC 2-BIT UNDIRECTIONAL VOLTAGE-LEVEL TRANSLATOR X2SON8; Part_type: ICS\INTERFACE\LEVEL TRANSLATOR; Mfr_name: TEXAS INSTRUMENTS; Mistral Part No: 141016030002-R; Customs_HS_Code: 15%; Pb-Free: 85423100; Wattage: NA; Project: OCTASIC_3600; PCB Footprint: X2SON8_15-74_70X50; Chkd/date: VASANTHA/060516; Crtd /date: VASANTHA/030316; Datasheet: Y:\MIS_DATABASE\DATASHEETS\ICS\INTERFACE\SN74AVC2T244.PDF; Temperature: -40°C+85°C; Weight: NA; Height: 0.40MM; Distributor_part_number: 296-29674-1-ND; Distributor_name: DIGIKEY; Package: X2SON8; Voltage: NA; Tolerance: NA; Mfr_part_number: SN74AVC2T244DQMR; Library Ref: SN74AVC2T244DQMR_X2SON8
U85 = SN74AVC4T245RSV_UQFN16: IC 2-BIT BUS TRANSCEIVER WITH CONFIGURABLE VOLTAGE TRANSLATION AND 3 STATE O/P UQFN16; Part_type: ICS\DIGITAL\BUSTRANSCEIVER; Mfr_name: TEXAS INSTRUMENTS; Mistral Part No: 141011040011-R; Custom_Duty: 15%; Customs_HS_Code: 85423100; Wattage: NA; Project: HMC; PCB Footprint: UQFN16_TMUX1574_70X100_0-6; Footprint Path: Y:\MIS_DATABASE\Library\ALTIUM_TOOL\PCB_FOOTPRINTS\Altium_Footprint_Lib.PcbLib; Library Path: Y:\MIS_DATABASE\Library\ALTIUM_TOOL\SCHEMATICS_PARTS\MS_BUSDRIVERTRANSCEIVER_Library.schlib; MECHANICAL 3D STEP FILE: UQFN16_TMUX1574_70X100_0-6; Chkd/date: MANIRAJA/040520; Crtd /date: BAVISH/190411; Datasheet: Y:\MIS_DATABASE\DATASHEETS\ICS\DIGITAL\BUSTRANSCEIVER\SN74AVC4T245-SER.PDF; Temperature: -40°C+85°C; Weight: 41mg; Height: 0.55MM; Library Ref: SN74AVC4T245RSV_UQFN16; Distributor_part_number: 296-24366-1-ND; Distributor_name: DIGIKEY; Package: UQFN16; Voltage: NA; Tolerance: NA; Mfr_part_number: SN74AVC4T245RSVR; Footprint Ref: UQFN16_TMUX1574_70X100_0-6
U86 = TXS0102DQX_SON8: IC 2-BIT BI-DIR VOLTAGE-LEVEL TRANSLATOR FOR OPEN-DRAIN AND PUSH-PULL X2SON8; Mistral Part No: 141012050010-R; Mfr_name: TEXAS INSTRUMENTS; Part_type: ICS\INTERFACE\LEVEL TRANSLATOR; Project: GEN_3-8_DB; Tolerance: NA; Customs_HS_Code: 85423100; Custom_Duty: 15%; PCB Footprint: X2SON8_TXS0102_40X60_0-4; Footprint Ref: X2SON8_TXS0102_40X60_0-4; Mfr_part_number: TXS0102DQER; Voltage: NA; Wattage: NA; Package: X2SON8; Distributor_name: DIGIKEY; Distributor_part_number: 296-28368-1-ND; Library Ref: TXS0102DQX_SON8; Height: 0.40MM; Weight: 1.2mg; Temperature: -40°C+85°C; Datasheet: Y:\MIS_DATABASE\DATASHEETS\ICS\INTERFACE\TXS0102-SER.PDF; Crtd /date: CHAITHANYA230512; Chkd/date: MANIRAJA/010719; MECHANICAL 3D STEP FILE: X2SON8_TXS0102_40X60_0-4; Library Path: Y:\MIS_DATABASE\Library\ALTIUM_TOOL\SCHEMATICS_PARTS\MS_MISCINTERFACE_Library.schlib; Footprint Path: Y:\MIS_DATABASE\Library\ALTIUM_TOOL\PCB_FOOTPRINTS\Altium_Footprint_Lib.PcbLib
U88 = SN74AVC4T245RSV_UQFN16: IC 2-BIT BUS TRANSCEIVER WITH CONFIGURABLE VOLTAGE TRANSLATION AND 3 STATE O/P UQFN16; Mistral Part No: 141011040011-R; Mfr_name: TEXAS INSTRUMENTS; Part_type: ICS\DIGITAL\BUSTRANSCEIVER; Project: HMC; Tolerance: NA; Customs_HS_Code: 85423100; Custom_Duty: 15%; PCB Footprint: UQFN16_TMUX1574_70X100_0-6; Footprint Ref: UQFN16_TMUX1574_70X100_0-6; Mfr_part_number: SN74AVC4T245RSVR; Voltage: NA; Wattage: NA; Package: UQFN16; Distributor_name: DIGIKEY; Distributor_part_number: 296-24366-1-ND; Library Ref: SN74AVC4T245RSV_UQFN16; Height: 0.55MM; Weight: 41mg; Temperature: -40°C+85°C; Datasheet: Y:\MIS_DATABASE\DATASHEETS\ICS\DIGITAL\BUSTRANSCEIVER\SN74AVC4T245-SER.PDF; Crtd /date: BAVISH/190411; Chkd/date: MANIRAJA/040520; MECHANICAL 3D STEP FILE: UQFN16_TMUX1574_70X100_0-6; Library Path: Y:\MIS_DATABASE\Library\ALTIUM_TOOL\SCHEMATICS_PARTS\MS_BUSDRIVERTRANSCEIVER_Library.schlib; Footprint Path: Y:\MIS_DATABASE\Library\ALTIUM_TOOL\PCB_FOOTPRINTS\Altium_Footprint_Lib.PcbLib
U96 = SN74AVC2T244DQMR_X2SON8: IC 2-BIT UNDIRECTIONAL VOLTAGE-LEVEL TRANSLATOR X2SON8; Mistral Part No: 141016030002-R; Mfr_name: TEXAS INSTRUMENTS; Part_type: ICS\INTERFACE\LEVEL TRANSLATOR; Project: OCTASIC_3600; Tolerance: NA; Pb-Free: 85423100; Customs_HS_Code: 15%; PCB Footprint: X2SON8_15-74_70X50; Library Ref: SN74AVC2T244DQMR_X2SON8; Mfr_part_number: SN74AVC2T244DQMR; Voltage: NA; Wattage: NA; Package: X2SON8; Distributor_name: DIGIKEY; Distributor_part_number: 296-29674-1-ND; Height: 0.40MM; Weight: NA; Temperature: -40°C+85°C; Datasheet: Y:\MIS_DATABASE\DATASHEETS\ICS\INTERFACE\SN74AVC2T244.PDF; Crtd /date: VASANTHA/030316; Chkd/date: VASANTHA/060516